# EAGLE schematic AlteraMAX3000ACPLDbreakout-v1 (EAGLE 5.11)
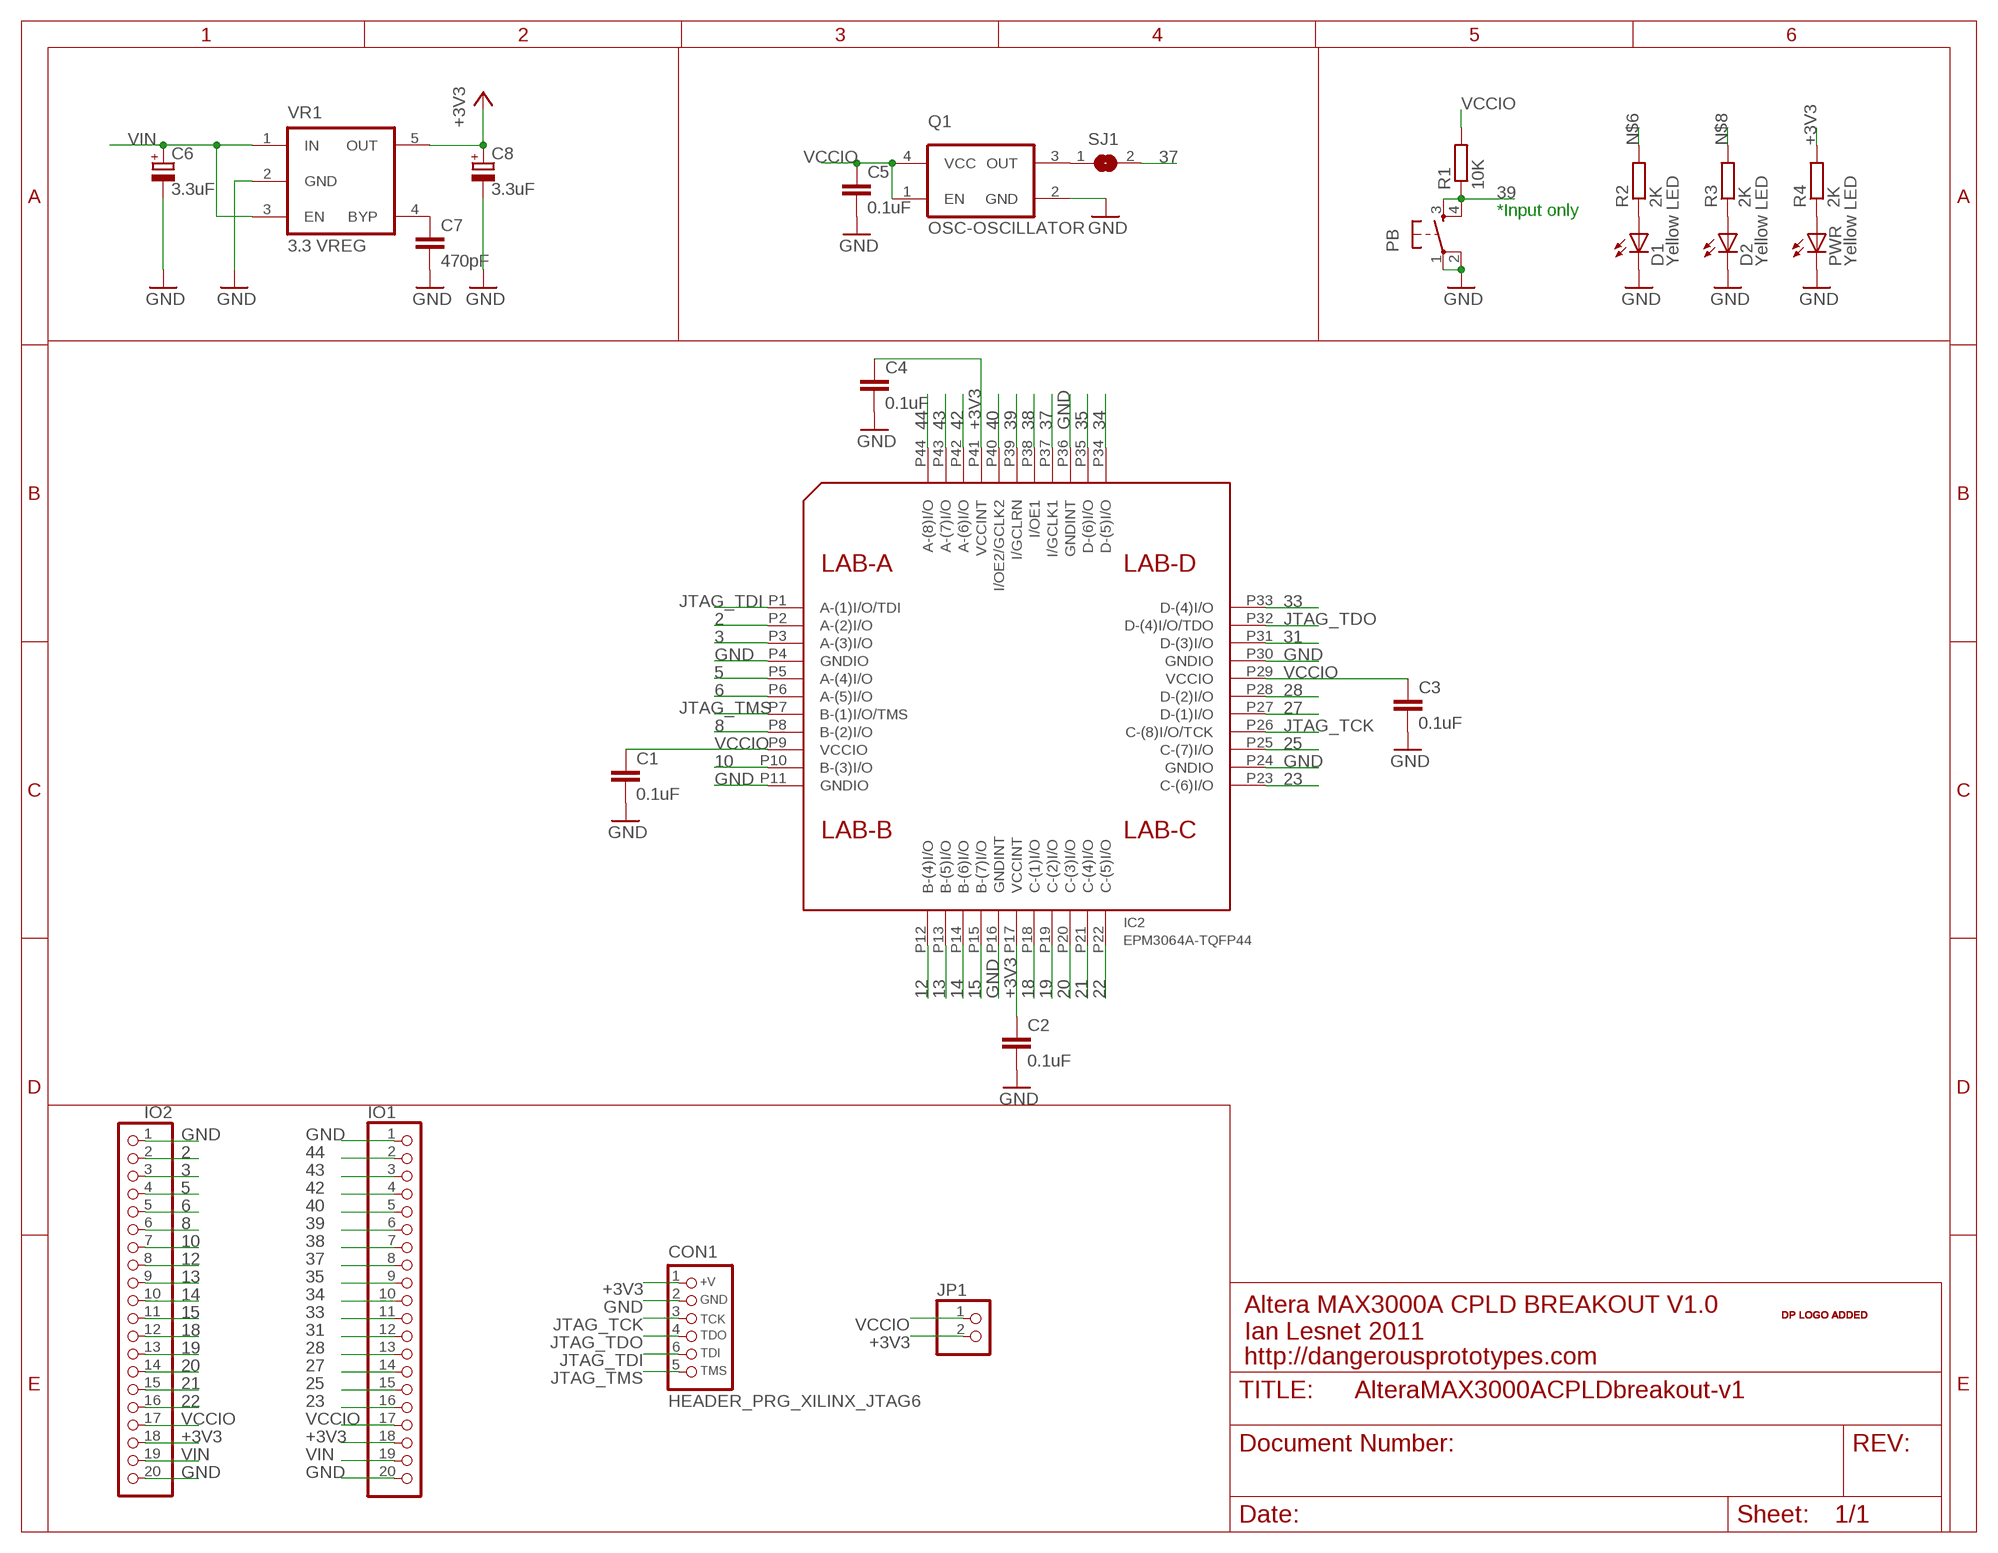
[diagram p0: schematic, sheet 1]

## Parts
C1  0.1uF  CAPC603  [C603]
C2  0.1uF  CAPC603  [C603]
C3  0.1uF  CAPC603  [C603]
C4  0.1uF  CAPC603  [C603]
C5  0.1uF  CAPC603  [C603]
C6  3.3uF  CAP_POLSMC_A  [SMC_A]
C7  470pF  CAPC603  [C603]
C8  3.3uF  CAP_POLSMC_A  [SMC_A]
CON1  HEADER_PRG_XILINX_JTAG6  [HEADER_PRG_1X06]
D1  Yellow LED  LED805  [LED-805]
D2  Yellow LED  LED805  [LED-805]
IC2  EPM3064A-TQFP44  [TQFP44]
IO1  PINHD-1X20  [1X20]
IO2  PINHD-1X20  [1X20]
JP1  PINHD-1X02_2.54-S  [1X02-S]
PB  SMD button small  SMD_TACT_SMALL  [TACT_SWITCH_SMALL]
PWR  Yellow LED  LED805  [LED-805]
Q1  OSC-OSCILLATOR  [OSCILLATOR_7X5_SMD]
R1  10K  RESISTORR603  [R603]
R2  2K  RESISTORR603  [R603]
R3  2K  RESISTORR603  [R603]
R4  2K  RESISTORR603  [R603]
SJ1  SJ  [SJ]
U$1  DP_LOGO  [DP_LOGO]
VR1  3.3 VREG  MIC5205  [SOT-23-5]

## Nets
2: IC2.P2(A-(2)I/O) IO2.2
3: IC2.P3(A-(3)I/O) IO2.3
5: IC2.P5(A-(4)I/O) IO2.4
6: IC2.P6(A-(5)I/O) IO2.5
8: IC2.P8(B-(2)I/O) IO2.6
10: IC2.P10(B-(3)I/O) IO2.7
12: IC2.P12(B-(4)I/O) IO2.8
13: IC2.P13(B-(5)I/O) IO2.9
14: IC2.P14(B-(6)I/O) IO2.10
15: IC2.P15(B-(7)I/O) IO2.11
18: IC2.P18(C-(1)I/O) IO2.12
19: IC2.P19(C-(2)I/O) IO2.13
20: IC2.P20(C-(3)I/O) IO2.14
21: IC2.P21(C-(4)I/O) IO2.15
22: IC2.P22(C-(5)I/O) IO2.16
23: IC2.P23(C-(6)I/O) IO1.16
25: IC2.P25(C-(7)I/O) IO1.15
27: IC2.P27(D-(1)I/O) IO1.14
28: IC2.P28(D-(2)I/O) IO1.13
31: IC2.P31(D-(3)I/O) IO1.12
33: IC2.P33(D-(4)I/O) IO1.11
34: IC2.P34(D-(5)I/O) IO1.10
35: IC2.P35(D-(6)I/O) IO1.9
37: IC2.P37(I/GCLK1) IO1.8 SJ1.2
38: IC2.P38(I/OE1) IO1.7
39: IC2.P39(I/GCLRN) IO1.6 PB.3 PB.4 R1.1
40: IC2.P40(I/OE2/GCLK2) IO1.5
42: IC2.P42(A-(6)I/O) IO1.4
43: IC2.P43(A-(7)I/O) IO1.3
44: IC2.P44(A-(8)I/O) IO1.2
+3V3: C2.1 C4.1 C8.+ CON1.1(+V) IC2.P17(VCCINT) IC2.P41(VCCINT) IO1.18 IO2.18 JP1.2 R4.2 VR1.5(OUT)
GND: C1.2 C2.2 C3.2 C4.2 C5.2 C6.- C7.2 C8.- CON1.2(GND) D1.C D2.C IC2.P4(GNDIO) IC2.P11(GNDIO) IC2.P16(GNDINT) IC2.P24(GNDIO) IC2.P30(GNDIO) IC2.P36(GNDINT) IO1.1 IO1.20 IO2.1 IO2.20 PB.1 PB.2 PWR.C Q1.2(GND) VR1.2(GND)
JTAG_TCK: CON1.3(TCK) IC2.P26(C-(8)I/O/TCK)
JTAG_TDI: CON1.6(TDI) IC2.P1(A-(1)I/O/TDI)
JTAG_TDO: CON1.4(TDO) IC2.P32(D-(4)I/O/TDO)
JTAG_TMS: CON1.5(TMS) IC2.P7(B-(1)I/O/TMS)
N$1: D1.A R2.1
N$2: D2.A R3.1
N$3: PWR.A R4.1
N$5: Q1.3(OUT) SJ1.1
N$6: R2.2
N$7: C7.1 VR1.4(BYP)
N$8: R3.2
VCCIO: C1.1 C3.1 C5.1 IC2.P9(VCCIO) IC2.P29(VCCIO) IO1.17 IO2.17 JP1.1 Q1.1(EN) Q1.4(VCC) R1.2
VIN: C6.+ IO1.19 IO2.19 VR1.1(IN) VR1.3(EN)

## Notes on the sheet
- *Input only
- Altera MAX3000A CPLD BREAKOUT V1.0
- Ian Lesnet 2011
- http://dangerousprototypes.com

## Library data of the parts
C1-C5 C7 = dp_devices:CAP
C6 C8 = dp_devices:CAP_POL
CON1 = dp_devices:HEADER_PRG_XILINX_JTAG6: 6-pin Xilinx JTAG programming header
D1 D2 PWR = dp_devices:LED
IC2 = dp_devices:EPM3064A: 64 Macrocells 3.3V CPLD
IO1 IO2 = pinhead:PINHD-1X20: PIN HEADER
JP1 = pinhead-2:PINHD-1X02: PIN HEADER
PB = dp_devices:SMD_TACT_SMALL
Q1 = dp_devices:OSC-OSCILLATOR: Oscillator
R1-R4 = dp_devices:RESISTOR
SJ1 = jumper:SJ: SMD solder JUMPER
U$1 = dp_devices:DP_LOGO; FF1: fullfillment by; FF2: Seeed studio; FF3: www.seeedstudio.com; LICENSE: CC-BY-SA; PROJECT: project; URL1: http://; URL2: DangerousPrototypes.com
VR1 = dp_devices:MIC5205: 150ma Low-Noise LDO Regulator